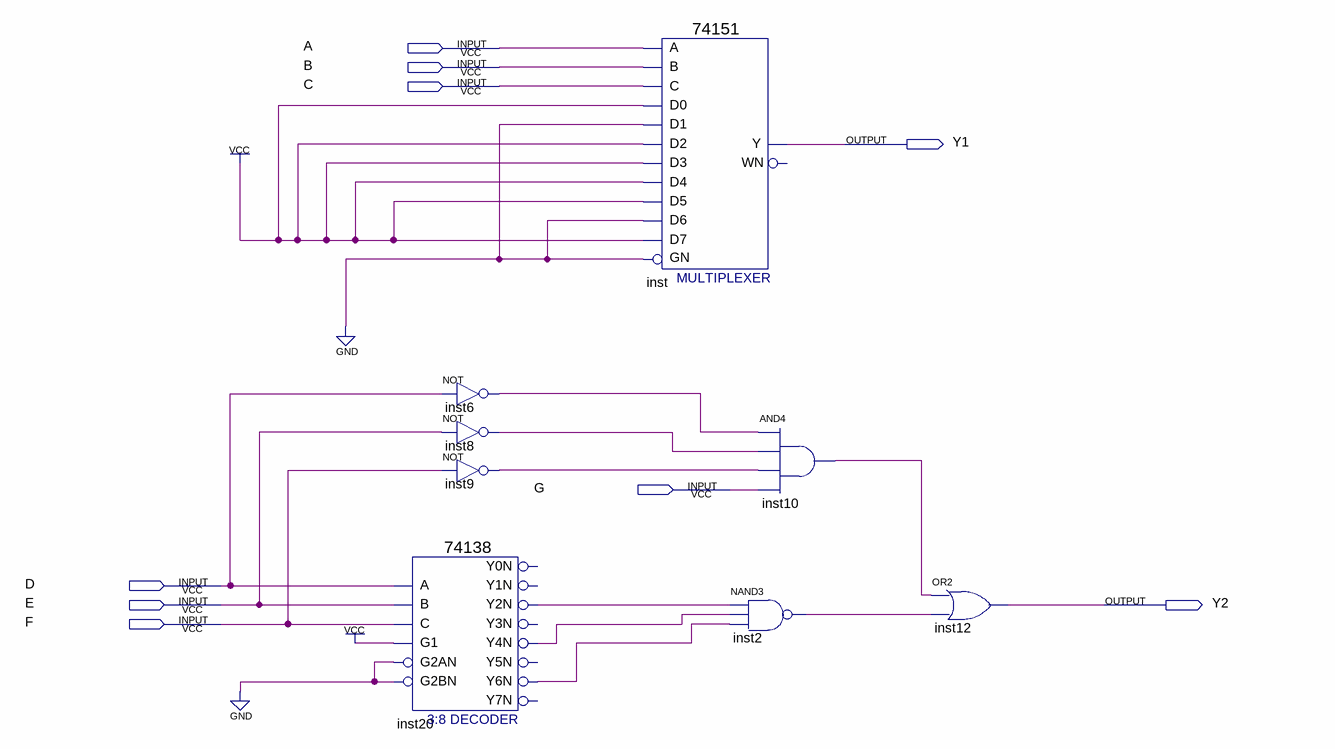
[diagram p0: schematic sheet]
// Quartus schematic 74LS151.bdf as structural Verilog: 8 symbols, 9 pins
module \74LS151  (
  input  A,
  input  B,
  input  C,
  input  G,
  input  D,
  input  E,
  input  F,
  output Y1,
  output Y2
);

  wire inst2_out, inst6_out, inst8_out, inst9_out, inst10_out, inst20_y2n, inst20_y4n, inst20_y6n;

  not inst6 (inst6_out, D);
  not inst8 (inst8_out, E);
  not inst9 (inst9_out, F);
  \74138  inst20 (
    .A(D), .B(E), .G1(1'b1), .C(F), .G2AN(1'b0), .G2BN(1'b0), .Y2N(inst20_y2n), .Y4N(inst20_y4n),
    .Y6N(inst20_y6n));  // open: Y0N, Y1N, Y3N, Y5N, Y7N
  \74151  inst (
    .GN(1'b0), .C(C), .B(B), .A(A), .D5(1'b1), .D0(1'b1), .D1(1'b0), .D4(1'b1), .D3(1'b1), .D2(1'b1),
    .D6(1'b0), .D7(1'b1), .Y(Y1));  // open: WN
  nand inst2 (inst2_out, inst20_y2n, inst20_y4n, inst20_y6n);
  and inst10 (inst10_out, inst6_out, inst8_out, inst9_out, G);
  or inst12 (Y2, inst10_out, inst2_out);
endmodule
